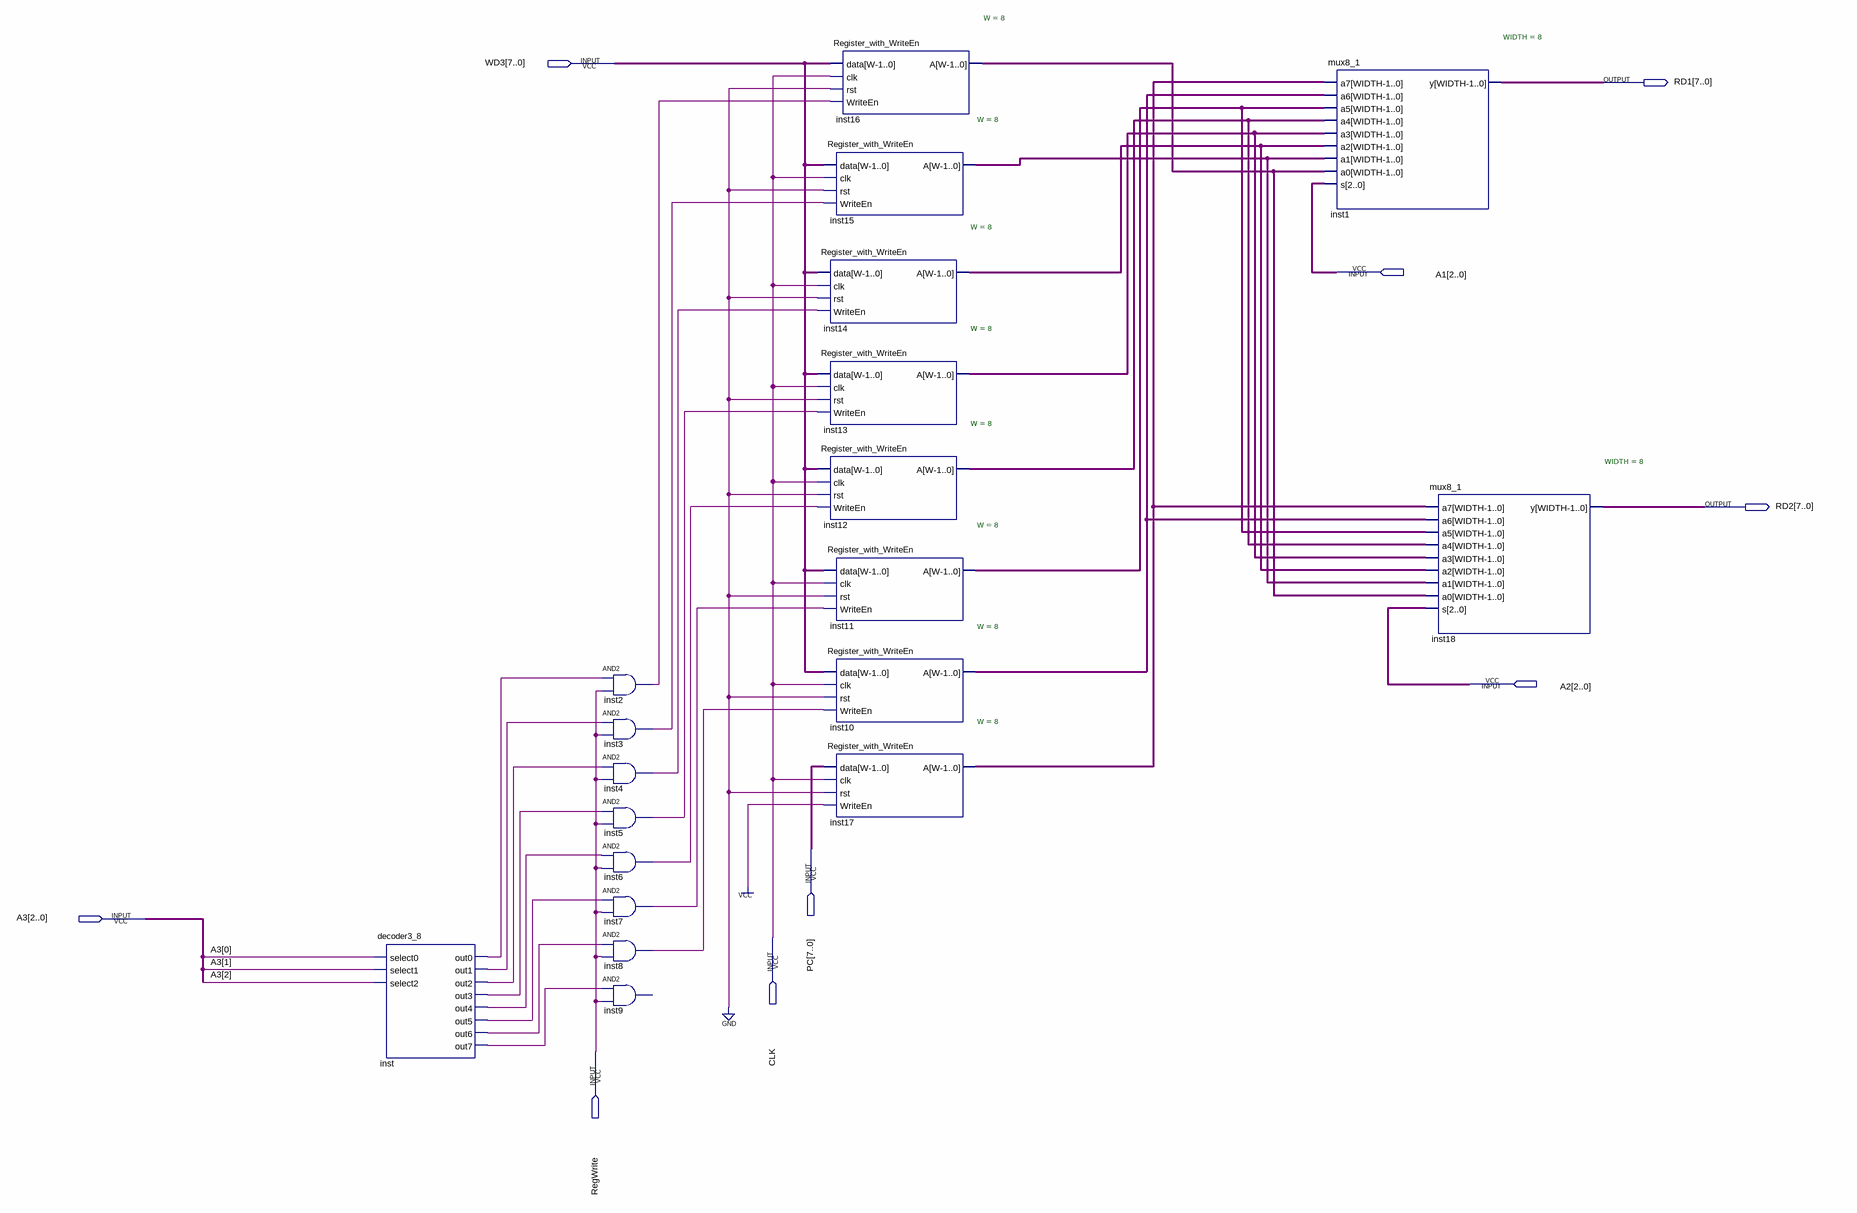
[diagram p0: schematic sheet]
// Quartus schematic RegFile.bdf as structural Verilog: 19 symbols, 9 pins
module RegFile (
  input  [7:0] WD3,
  input  [2:0] A1,
  input  [2:0] A2,
  input  [7:0] PC,
  input  [2:0] A3,
  input  CLK,
  input  RegWrite,
  output [7:0] RD1,
  output [7:0] RD2
);

  wire inst2_out, inst3_out, inst4_out, inst5_out, inst6_out, inst7_out, inst8_out, inst_out0, inst_out1,
       inst_out2, inst_out3, inst_out4, inst_out5, inst_out6, inst_out7;
  wire [7:0] inst10_a, inst11_a, inst12_a, inst13_a, inst14_a, inst15_a, inst16_a, inst17_a;

  decoder3_8 inst (
    .select0(A3[0]), .select1(A3[1]), .select2(A3[2]), .out0(inst_out0), .out1(inst_out1), .out2(inst_out2),
    .out3(inst_out3), .out4(inst_out4), .out5(inst_out5), .out6(inst_out6), .out7(inst_out7));
  and inst2 (inst2_out, inst_out0, RegWrite);
  and inst3 (inst3_out, inst_out1, RegWrite);
  and inst4 (inst4_out, inst_out2, RegWrite);
  and inst5 (inst5_out, inst_out3, RegWrite);
  and inst6 (inst6_out, inst_out4, RegWrite);
  and inst7 (inst7_out, inst_out5, RegWrite);
  and inst8 (inst8_out, inst_out6, RegWrite);
  // AND2 inst9 has open pins: IN1=inst_out7, IN2=RegWrite, OUT=open
  Register_with_WriteEn #(.W(8)) inst16 (.data(WD3), .clk(CLK), .rst(1'b0), .WriteEn(inst2_out), .A(inst16_a));
  Register_with_WriteEn #(.W(8)) inst15 (.data(WD3), .clk(CLK), .rst(1'b0), .WriteEn(inst3_out), .A(inst15_a));
  Register_with_WriteEn #(.W(8)) inst14 (.data(WD3), .clk(CLK), .rst(1'b0), .WriteEn(inst4_out), .A(inst14_a));
  Register_with_WriteEn #(.W(8)) inst13 (.data(WD3), .clk(CLK), .rst(1'b0), .WriteEn(inst5_out), .A(inst13_a));
  Register_with_WriteEn #(.W(8)) inst12 (.data(WD3), .clk(CLK), .rst(1'b0), .WriteEn(inst6_out), .A(inst12_a));
  Register_with_WriteEn #(.W(8)) inst11 (.data(WD3), .clk(CLK), .rst(1'b0), .WriteEn(inst7_out), .A(inst11_a));
  Register_with_WriteEn #(.W(8)) inst10 (.data(WD3), .clk(CLK), .rst(1'b0), .WriteEn(inst8_out), .A(inst10_a));
  Register_with_WriteEn #(.W(8)) inst17 (.data(PC), .clk(CLK), .rst(1'b0), .WriteEn(1'b1), .A(inst17_a));
  mux8_1 #(.WIDTH(8)) inst1 (
    .a7(inst17_a), .a6(inst10_a), .a5(inst11_a), .a4(inst12_a), .a3(inst13_a), .a2(inst14_a), .a1(inst15_a),
    .a0(inst16_a), .s(A1), .y(RD1));
  mux8_1 #(.WIDTH(8)) inst18 (
    .a7(inst17_a), .a6(inst10_a), .a5(inst11_a), .a4(inst12_a), .a3(inst13_a), .a2(inst14_a), .a1(inst15_a),
    .a0(inst16_a), .s(A2), .y(RD2));
endmodule
